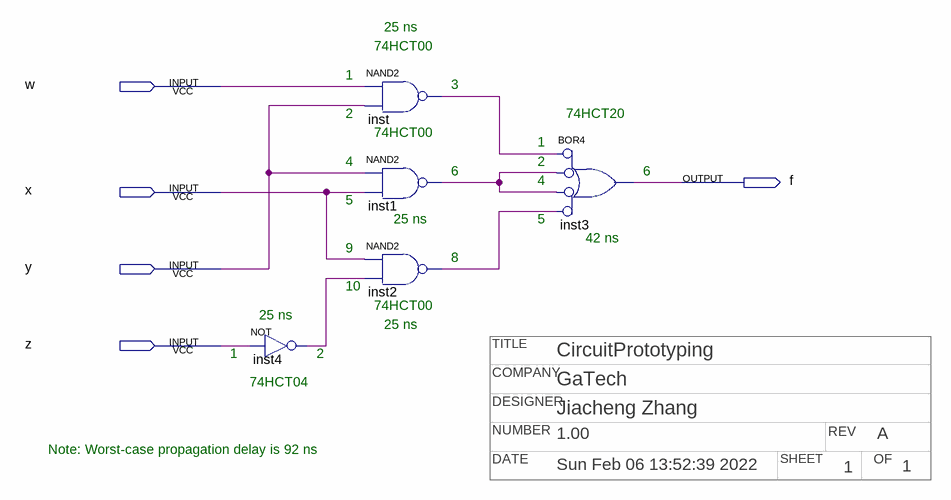
[diagram p0: schematic sheet]
// Quartus schematic CircuitPrototyping.bdf as structural Verilog: 5 symbols, 5 pins
// Title block: COMPANY: GaTech; DATE: Sun Feb 06 13:52:39 2022; DESIGNER: Jiacheng Zhang; NUMBER: 1.00; OF: 1; REV: A; SHEET: 1; TITLE: CircuitPrototyping
module CircuitPrototyping (
  input  w,
  input  x,
  input  y,
  input  z,
  output f
);

  wire inst1_out, inst2_out, inst4_out, inst_out;

  not inst4 (inst4_out, z);
  nand inst (inst_out, w, y);
  nand inst1 (inst1_out, y, x);
  nand inst2 (inst2_out, x, inst4_out);
  or inst3 (f, ~inst_out, ~inst1_out, ~inst1_out, ~inst2_out);  // BOR4

  // Notes on the sheet:
  //   25 ns
  //   74HCT00
  //   1
  //   3
  //   2
  //   74HCT20
  //   74HCT00
  //   1
  //   4
  //   2
  //   6
  //   6
  //   4
  //   5
  //   25 ns
  //   5
  //   42 ns
  //   9
  //   8
  //   10
  //   74HCT00
  //   25 ns
  //   25 ns
  //   1
  //   2
  //   74HCT04
  //   Note: Worst-case propagation delay is 92 ns
endmodule
